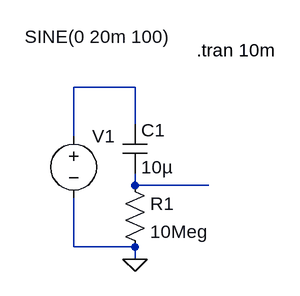
[diagram p0: schematic Draft1.asc]
Draft1.asc, the LTspice schematic file:
Version 4.1
SHEET 1 880 680
WIRE 16 64 -64 64
WIRE 16 112 16 64
WIRE -64 128 -64 64
WIRE 16 192 16 176
WIRE 112 192 16 192
WIRE -64 272 -64 208
WIRE 16 272 -64 272
WIRE 16 288 16 272
FLAG 16 288 0
SYMBOL res 0 176 R0
SYMATTR InstName R1
SYMATTR Value 10Meg
SYMBOL cap 0 112 R0
SYMATTR InstName C1
SYMATTR Value 10µ
SYMBOL voltage -64 112 R0
WINDOW 3 -64 -114 Left 2
WINDOW 123 0 0 Left 0
WINDOW 39 0 0 Left 0
SYMATTR InstName V1
SYMATTR Value SINE(0 20m 100)
TEXT 96 16 Left 2 !.tran 10m

The netlist it stands for:
* Draft1.asc
R1 N002 0 10Meg
C1 N001 N002 10µ
V1 N001 0 SINE(0 20m 100)
.tran 10m
.backanno
.end